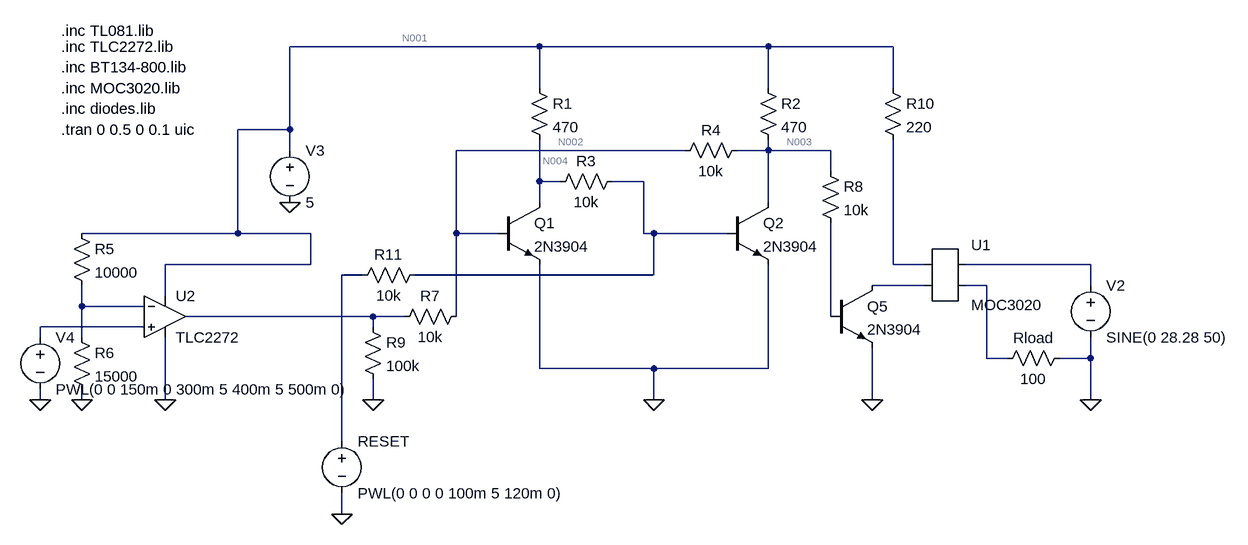
[diagram p0: schematic Draft6.asc]
* Draft6.asc
R1 N001 N004 470
R2 N001 N003 470
R4 N002 N003 10k
R3 N004 N005 10k
Q1 N004 N002 0 0 2N3904
Q2 N003 N005 0 0 2N3904
Rload N010 0 100
V2 N007 0 SINE(0 28.28 50)
V3 N001 0 5
XU2 N014 N011 N001 0 N012 TLC2272 TLC2272  ; pins In+ In- V+ V- OUT
R5 N001 N011 10000
R6 N011 0 15000
V4 N014 0 PWL(0 0 150m 0 300m 5 400m 5 500m 0)
V§RESET N008 0 PWL(0 0 0 0 100m 5 120m 0)
R7 N012 N002 10k
R10 N001 N006 220
Q5 N009 N013 0 0 2N3904
R8 N003 N013 10k
R9 N012 0 100k
R11 N008 N005 10k
* U1: MOC3020 (symbol AutoGenerated\MOC3020 not available, pins judged from their places): pin1=N006 pin2=N009 pin3=N007 pin4=N010
.model NPN NPN
.model PNP PNP
.lib standard.bjt
.inc diodes.lib
.tran 0 0.5 0 0.1 uic
.inc MOC3020.lib
.inc BT134-800.lib
.inc TLC2272.lib
.inc TL081.lib
.backanno
.end

* Results of the author's LTspice run, read from the files saved beside the schematic
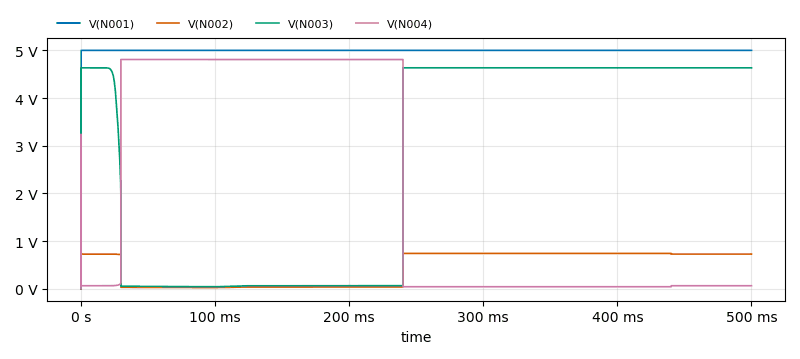
[diagram p1: Transient Analysis of Draft6.asc, plotted from the saved traces]
* Transient Analysis, 1 run:
*   V(N001): min 0 V, max 5 V, average 5 V, rms 5 V, last 5 V
*   V(N002): min 0 V, max 742.5 mV, average 441.1 mV, rms 561.7 mV, last 727.5 mV
*   V(N003): min 0 V, max 4.634 V, average 2.695 V, rms 3.513 V, last 4.634 V
*   V(N004): min 0 V, max 4.809 V, average 2.052 V, rms 3.119 V, last 64.18 mV